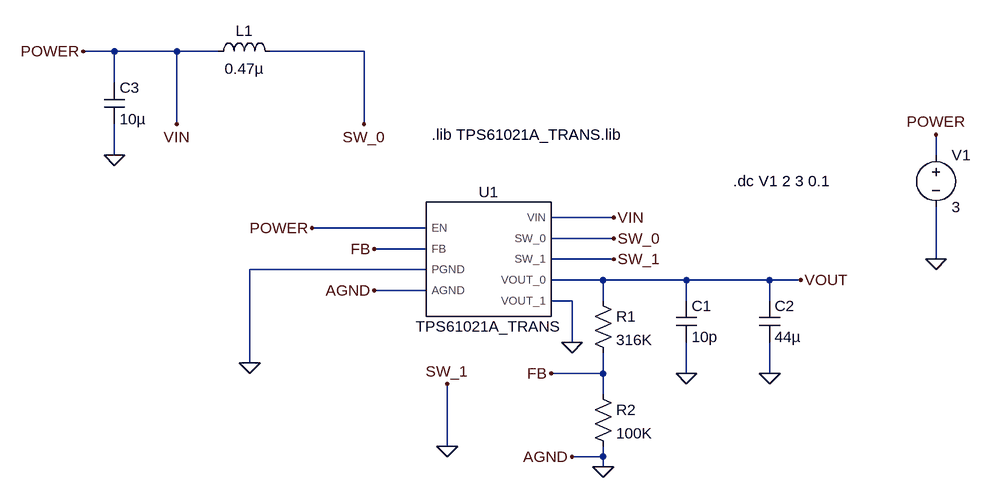
[diagram p0: schematic dc-dc_step_up.asc]
dc-dc_step_up.asc, the LTspice schematic file:
Version 4
SHEET 1 880 680
WIRE -464 -176 -512 -176
WIRE -368 -176 -464 -176
WIRE -304 -176 -368 -176
WIRE -80 -176 -224 -176
WIRE -464 -128 -464 -176
WIRE -368 -64 -368 -176
WIRE -80 -64 -80 -176
WIRE -464 -16 -464 -64
WIRE 800 -16 800 -48
WIRE 304 80 208 80
WIRE 16 96 -160 96
WIRE 304 112 208 112
WIRE 16 128 -64 128
WIRE 304 144 208 144
WIRE 800 144 800 64
WIRE 16 160 -256 160
WIRE 288 176 208 176
WIRE 416 176 288 176
WIRE 544 176 416 176
WIRE 592 176 544 176
WIRE 16 192 -64 192
WIRE 240 208 208 208
WIRE 288 208 288 176
WIRE 416 208 416 176
WIRE 544 208 544 176
WIRE 240 272 240 208
WIRE -256 304 -256 160
WIRE 288 320 288 288
WIRE 288 320 208 320
WIRE 416 320 416 272
WIRE 544 320 544 272
WIRE 288 352 288 320
WIRE 48 432 48 336
WIRE 288 448 288 432
WIRE 288 448 240 448
WIRE 288 464 288 448
FLAG 800 144 0
FLAG -160 96 POWER
FLAG -256 304 0
FLAG 800 -48 POWER
FLAG 544 320 0
FLAG 416 320 0
FLAG 288 464 0
FLAG -64 128 FB
FLAG 208 320 FB
FLAG 592 176 VOUT
FLAG -512 -176 POWER
FLAG 304 80 VIN
FLAG -368 -64 VIN
FLAG 304 112 SW_0
FLAG -80 -64 SW_0
FLAG 304 144 SW_1
FLAG 48 336 SW_1
FLAG 48 432 0
FLAG 240 272 0
FLAG -64 192 AGND
FLAG 240 448 AGND
FLAG -464 -16 0
SYMBOL TPS61021A_TRANS 112 144 R0
SYMATTR InstName U1
SYMBOL cap 400 208 R0
SYMATTR InstName C1
SYMATTR Value 10p
SYMBOL voltage 800 -32 R0
WINDOW 123 0 0 Left 0
WINDOW 39 0 0 Left 0
SYMATTR InstName V1
SYMATTR Value 3
SYMBOL cap 528 208 R0
SYMATTR InstName C2
SYMATTR Value 44µ
SYMBOL res 272 192 R0
SYMATTR InstName R1
SYMATTR Value 316K
SYMBOL res 272 336 R0
SYMATTR InstName R2
SYMATTR Value 100K
SYMBOL ind -320 -160 R270
WINDOW 0 32 56 VTop 2
WINDOW 3 5 56 VBottom 2
SYMATTR InstName L1
SYMATTR Value 0.47µ
SYMBOL cap -480 -128 R0
SYMATTR InstName C3
SYMATTR Value 10µ
TEXT 24 -48 Left 2 !.lib TPS61021A_TRANS.lib
TEXT 488 24 Left 2 !.dc V1 2 3 0.1

The netlist it stands for:
* dc-dc_step_up.asc
XU1 VIN FB 0 0 VIN SW_0 0 VOUT 0 TPS61021A_TRANS  ; pins EN FB PGND AGND VIN SW_0 SW_1 VOUT_0 VOUT_1
C1 VOUT 0 10p
V1 VIN 0 3
C2 VOUT 0 44µ
R1 VOUT FB 316K
R2 FB 0 100K
L1 VIN SW_0 0.47µ
C3 VIN 0 10µ
.lib TPS61021A_TRANS.lib
.dc V1 2 3 0.1
.lib C:\Users\filip\Desktop\PROGRAMMING\stm32f4_remote_controller\pcb\spice_simulation\dc-dc_step-up\SLVMBI5A\TPS61021A_TRANS.LIB
.backanno
.end